# Altium project boardboard3.PrjPcb
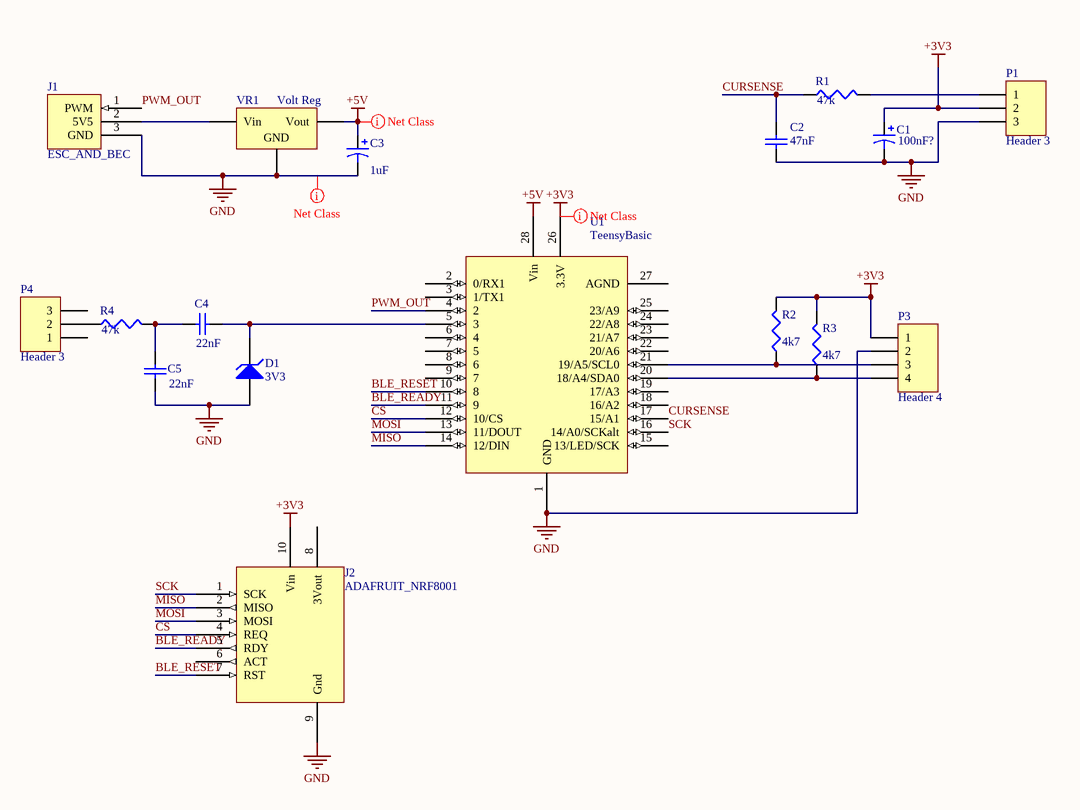
[diagram p0: boardboard.SchDoc]
1 sheet, 17 parts. Net scope: global (net labels, ports and power ports of the same name join across sheets).
Board files: PCB2.PcbDoc, PCB1.PcbDoc

## Sheet boardboard.SchDoc
size Letter

### Parts
C1  value 100nF?  [C0805]  (hidden comment: Cap Pol3)
C2  value 47nF  [C0805]  (hidden comment: Cap)
C3  value 1uF  [C0805]  (hidden comment: Cap Pol3)
C4  value 22nF  [C0805]  (hidden comment: Cap)
C5  value 22nF  [C0805]  (hidden comment: Cap)
D1  3V3  [DO-35]
J1  ESC_AND_BEC  [HDR1X3H]
J2  ADAFRUIT_NRF8001  [HDR1X10]
P1  Header 3  [HDR1X3H]
P3  Header 4  [HDR1x4H]
P4  Header 3  [HDR1X3H]
R1  value 47k  [6-0805_N]  (hidden comment: Res3)
R2  value 4k7  [6-0805_N]  (hidden comment: Res3)
R3  value 4k7  [6-0805_N]  (hidden comment: Res3)
R4  value 47k  [6-0805_N]  (hidden comment: Res3)
U1  TeensyBasic  [TeensyBasic]
VR1  Volt Reg  [SOT223_N]

### Nets
+3V3: C1.1 J2.10(Vin) P1.2 P3.1 R2.2 R3.2 U1.26(3.3V)
+5V: C3.1 U1.28(Vin) VR1.3(Vout)
GND: C1.2 C2.1 C3.2 C5.1 D1.1(A) J1.3(GND) J2.9(Gnd) P1.3 P3.2 U1.1(GND) VR1.2(GND)
BLE_READY: J2.5(RDY) U1.11(9)
BLE_RESET: J2.7(RST) U1.10(8)
CS: J2.4(REQ) U1.12(10/CS)
CURSENSE: C2.2 R1.1 U1.17(15/A1)
MISO: J2.2(MISO) U1.14(12/DIN)
MOSI: J2.3(MOSI) U1.13(11/DOUT)
PWM_OUT: J1.1(PWM) U1.4(2)
SCK: J2.1(SCK) U1.16(14/A0/SCKalt)
NetC4_1: C4.1 C5.2 R4.2
NetC4_2: C4.2 D1.2(K) U1.5(3)
NetJ1_2: J1.2(5V5) VR1.1(Vin)
NetP1_1: P1.1 R1.2
NetP3_3: P3.3 R2.1 U1.21(19/A5/SCL0)
NetP3_4: P3.4 R3.1 U1.20(18/A4/SDA0)
NetP4_2: P4.2 R4.1

Not connected (* = marked no-connect by the designer): J2 6(ACT) 8(3Vout); P4 1 3; U1 2(0/RX1) 3(1/TX1) 6(4) 7(5) 8(6) 9(7) 15(13/LED/SCK) 18(16/A2) 19(17/A3) 22(20/A6) 23(21/A7) 24(22/A8) 25(23/A9) 27(AGND)

### Layout directives
net class Power: +3V3, +5V, GND

### Library data of the parts
C1 C3 = Cap Pol3: Polarized Capacitor (Surface Mount); Published: 8-Jun-2000; LatestRevisionDate: 29-May-2009; LatestRevisionNote: IPC-7351 Footprint Added.; PackageReference: C0805; Publisher: Altium Limited; PackageDescription: Chip Capacitor
C2 C4 C5 = Cap: Capacitor; Published: 8-Jun-2000; LatestRevisionDate: 17-Jul-2002; LatestRevisionNote: Re-released for DXP Platform.; PackageReference: RAD-0.3; Publisher: Altium Limited; PackageDescription: Radial Cap, Thru-Hole; 2 Leads; 0.3 in Pin Spacing
D1 = D Zener: Zener Diode; Published: 8-Jun-2000; LatestRevisionDate: 17-Jul-2002; LatestRevisionNote: Re-released for DXP Platform.; PackageReference: DIODE-0.7; Publisher: Altium Limited; PackageDescription: Diode, Thru-Hole; 2 Leads; 0.7 in Pin Spacing
P1 P4 = Header 3: Header, 3-Pin; LatestRevisionDate: 17-Jul-2002; LatestRevisionNote: Re-released for DXP Platform.; Publisher: Altium Limited
P3 = Header 4: Header, 4-Pin; LatestRevisionDate: 17-Jul-2002; LatestRevisionNote: Re-released for DXP Platform.; Publisher: Altium Limited
R1-R4 = Res3: Resistor; Published: 8-Jun-2000; LatestRevisionDate: 29-May-2009; LatestRevisionNote: IPC-7351 Footprint Added.; PackageReference: J1-0603; Publisher: Altium Limited; PackageDescription: Chip Resistor
VR1 = Volt Reg: Voltage Regulator; Published: 24-Mar-1999; LatestRevisionDate: 29-May-2009; LatestRevisionNote: IPC-7351 Footprint Added.; PackageReference: D2PAK; Publisher: Altium Limited; PackageDescription: 3-Pin Transistor Outline Package 2.54 mm Pitch, 15.1 mm Lead Span